# EAGLE design RF Splitter active (EAGLE 9.6.2)
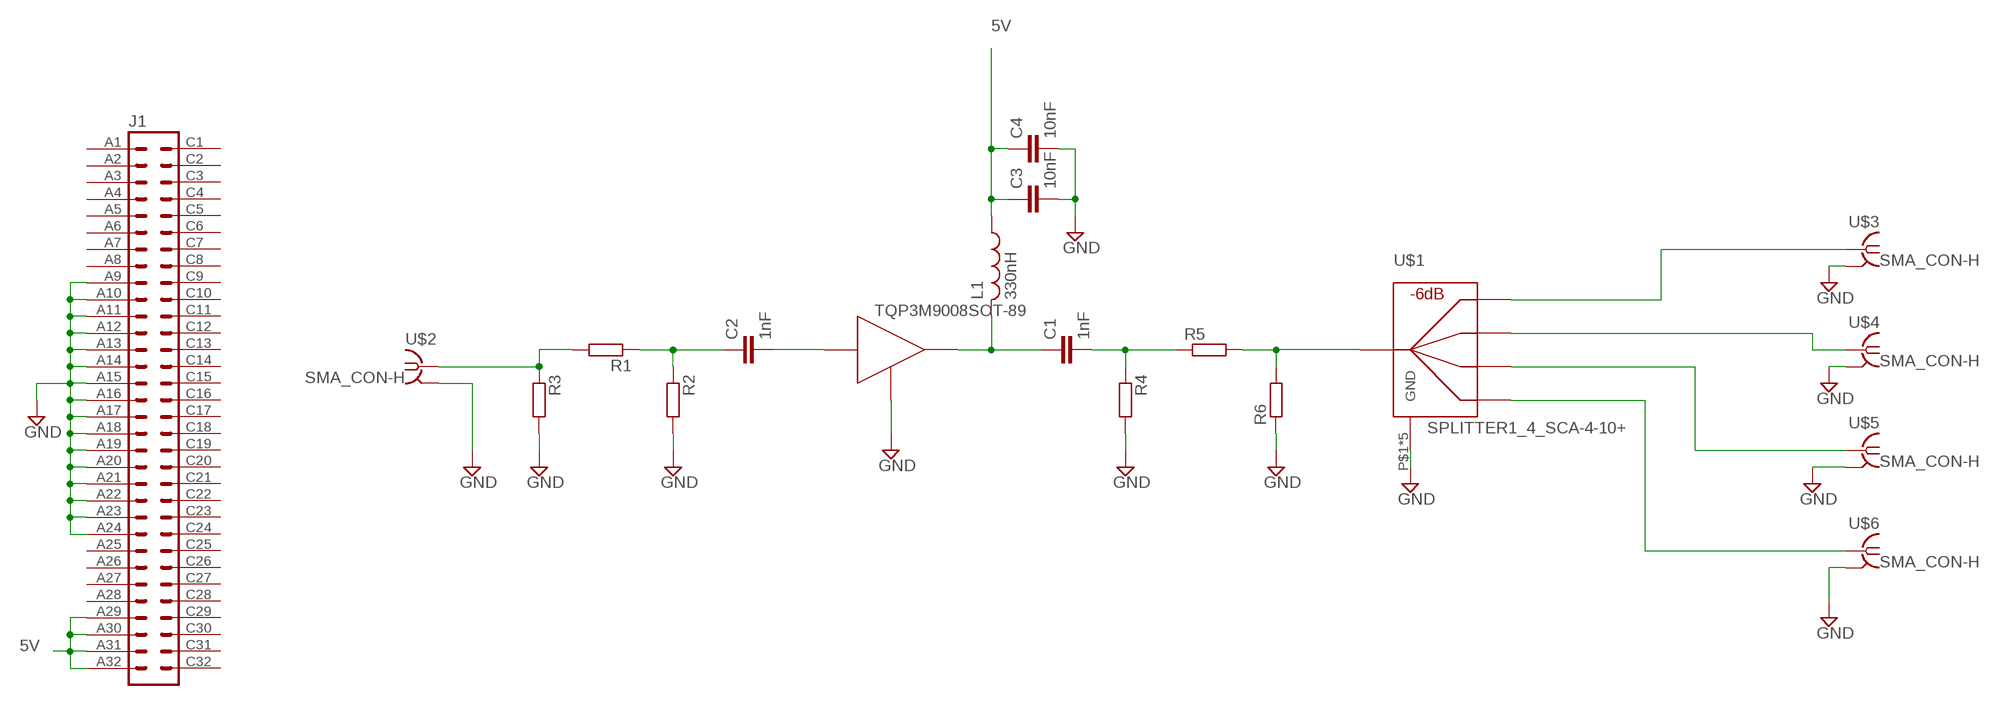
[diagram p0: schematic, sheet 1]

## Parts
C1  1nF  C-EUC0603  [C0603]
C2  1nF  C-EUC0603  [C0603]
C3  10nF  C-EUC0603  [C0603]
C4  10nF  C-EUC0603  [C0603]
J1  VG64P  [VG64P]
L1  330nH  L-USL2012C  [L2012C]
R1  R-EU_R0603  [R0603]
R2  R-EU_R0603  [R0603]
R3  R-EU_R0603  [R0603]
R4  R-EU_R0603  [R0603]
R5  R-EU_R0603  [R0603]
R6  R-EU_R0603  [R0603]
U$1  SPLITTER1_4_SCA-4-10+  [SCA-4-10+]
U$2  SMA_CON-H  [BU-SMA-H]
U$3  SMA_CON-H  [BU-SMA-H]
U$4  SMA_CON-H  [BU-SMA-H]
U$5  SMA_CON-H  [BU-SMA-H]
U$6  SMA_CON-H  [BU-SMA-H]
U$7  TQP3M9008SOT-89  [SOT89]

## Nets
5V: C3.1 C4.1 J1.A29 J1.A30 J1.A31 J1.A32 L1.1
GND: C3.2 C4.2 J1.A9 J1.A10 J1.A11 J1.A12 J1.A13 J1.A14 J1.A15 J1.A16 J1.A17 J1.A18 J1.A19 J1.A20 J1.A21 J1.A22 J1.A23 J1.A24 R2.2 R3.2 R4.2 R6.1 U$1.P$1(GND) U$1.P$2(GND) U$1.P$4(GND) U$1.P$5(GND) U$1.P$8(GND) U$2.2(GND) U$2.3(GND) U$2.4(GND) U$2.5(GND) U$3.2(GND) U$3.3(GND) U$3.4(GND) U$3.5(GND) U$4.2(GND) U$4.3(GND) U$4.4(GND) U$4.5(GND) U$5.2(GND) U$5.3(GND) U$5.4(GND) U$5.5(GND) U$6.2(GND) U$6.3(GND) U$6.4(GND) U$6.5(GND) U$7.2(GND) U$7.2@1(GND)
N$1: C2.2 U$7.1(IN)
N$2: U$1.P$6 U$3.1
N$3: U$1.P$7 U$4.1
N$4: U$1.P$9 U$5.1
N$5: U$1.P$10 U$6.1
N$6: C1.1 L1.2 U$7.3(OUT)
N$8: C1.2 R4.1 R5.1
N$9: R5.2 R6.2 U$1.P$3
N$10: R1.2 R3.1 U$2.1
N$12: C2.1 R1.1 R2.1
Unconnected: J1.A1 J1.A2 J1.A3 J1.A4 J1.A5 J1.A6 J1.A7 J1.A8 J1.A25 J1.A26 J1.A27 J1.A28 J1.C1 J1.C2 J1.C3 J1.C4 J1.C5 J1.C6 J1.C7 J1.C8 J1.C9 J1.C10 J1.C11 J1.C12 J1.C13 J1.C14 J1.C15 J1.C16 J1.C17 J1.C18 J1.C19 J1.C20 J1.C21 J1.C22 J1.C23 J1.C24 J1.C25 J1.C26 J1.C27 J1.C28 J1.C29 J1.C30 J1.C31 J1.C32

## Library data of the parts
C1-C4 = rcl:C-EU: CAPACITOR, European symbol; SPICEPREFIX: C
J1 = 19inch:VG64: PCB EUROCARD, 64-pin type C/AC, 2.54 mm
L1 = rcl:L-US: INDUCTOR, American symbol; SPICEPREFIX: L
R1-R6 = rcl:R-EU_: RESISTOR, European symbol; SPICEPREFIX: R
U$1 = Orzada:SPLITTER1_4: 1:4 Splitter Minicircuits
U$2-U$6 = Orzada:SMA_CON
U$7 = Orzada:TQP3M9008

## Board
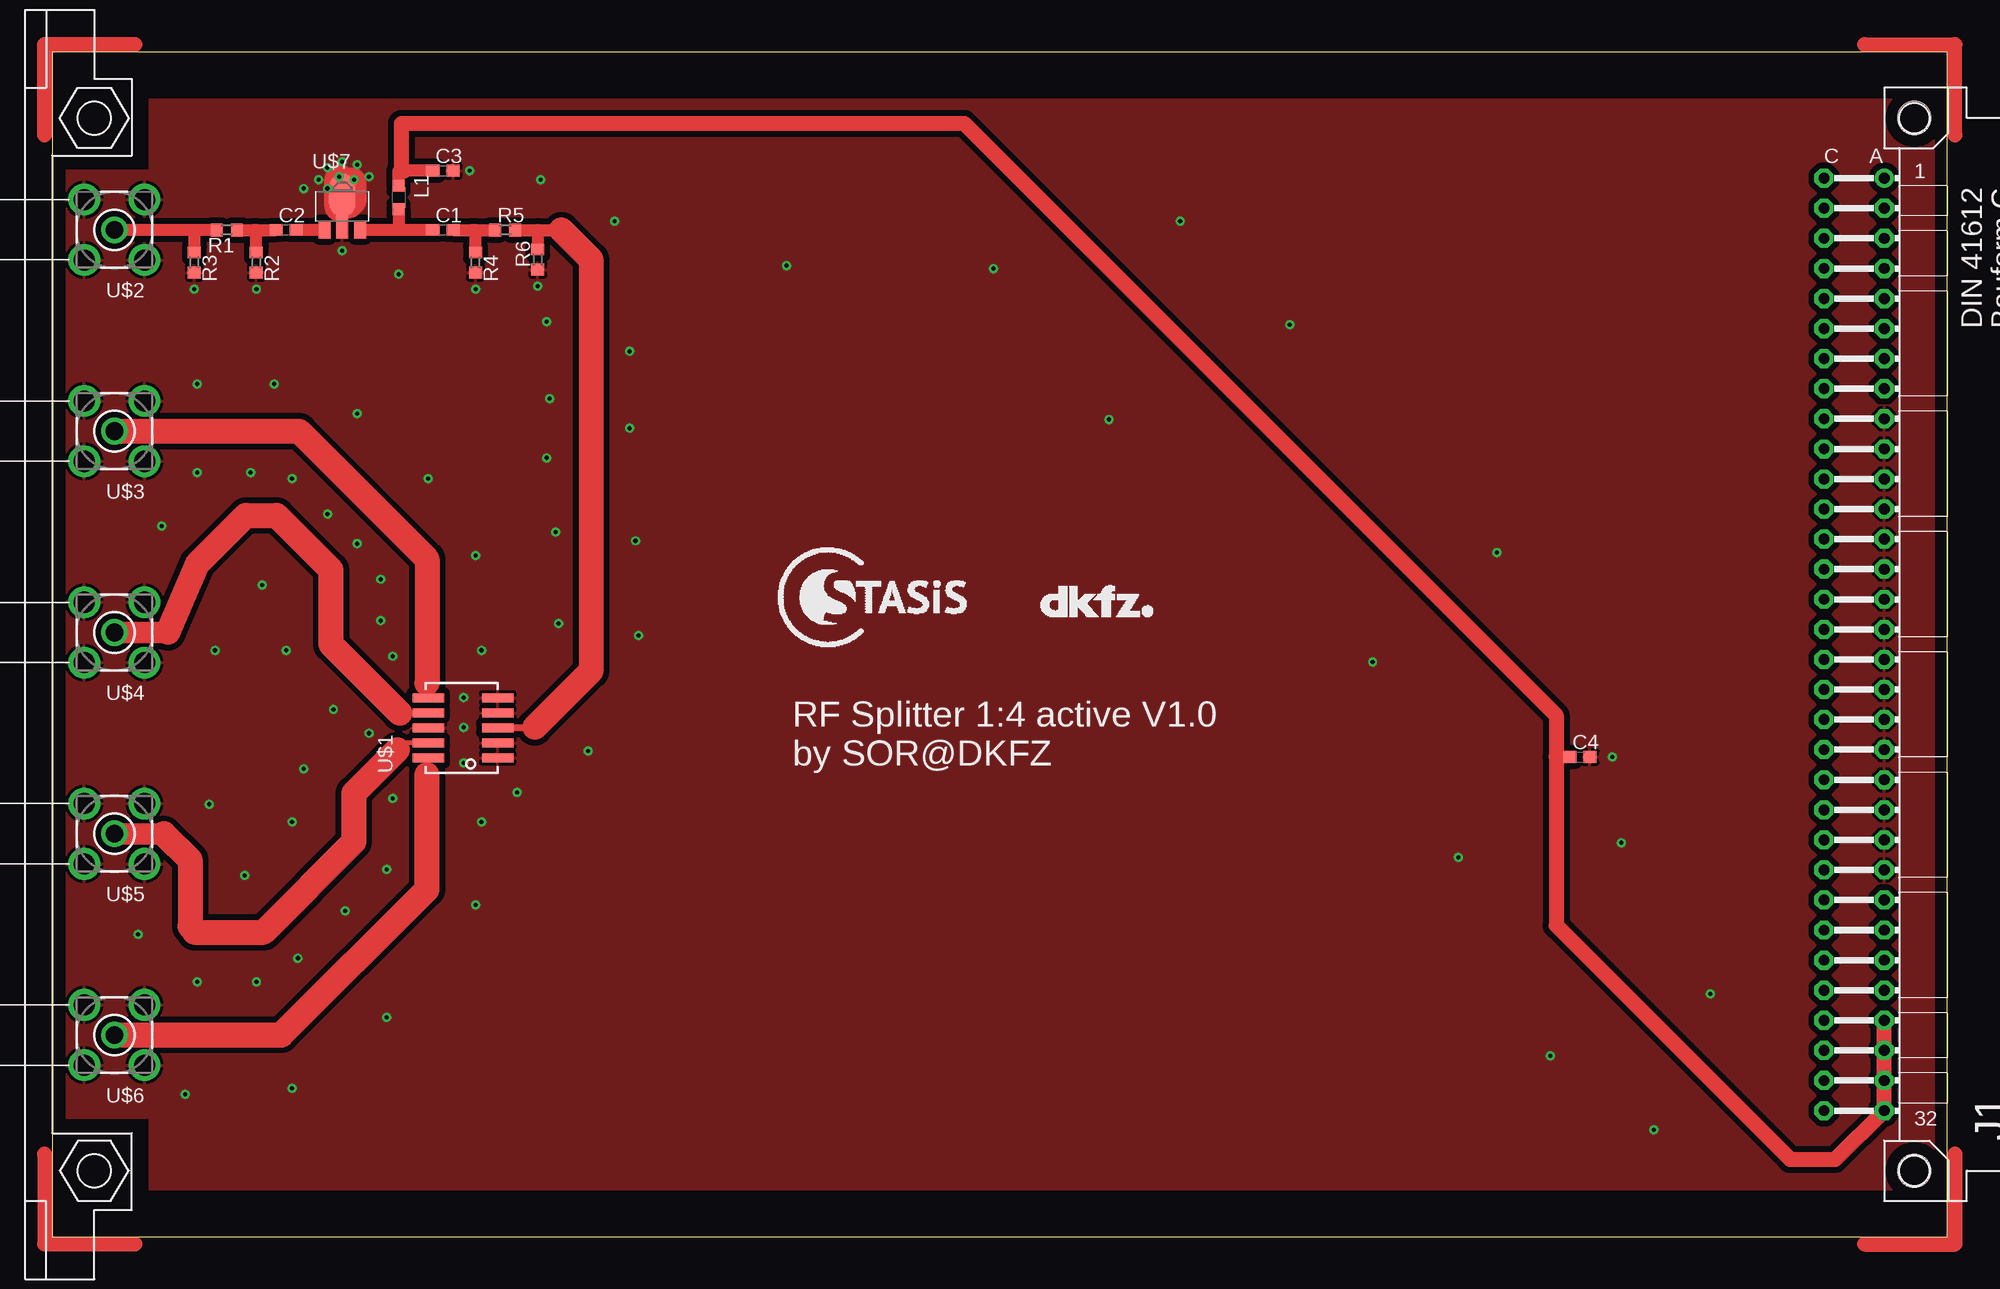
[diagram p1: board, top side]
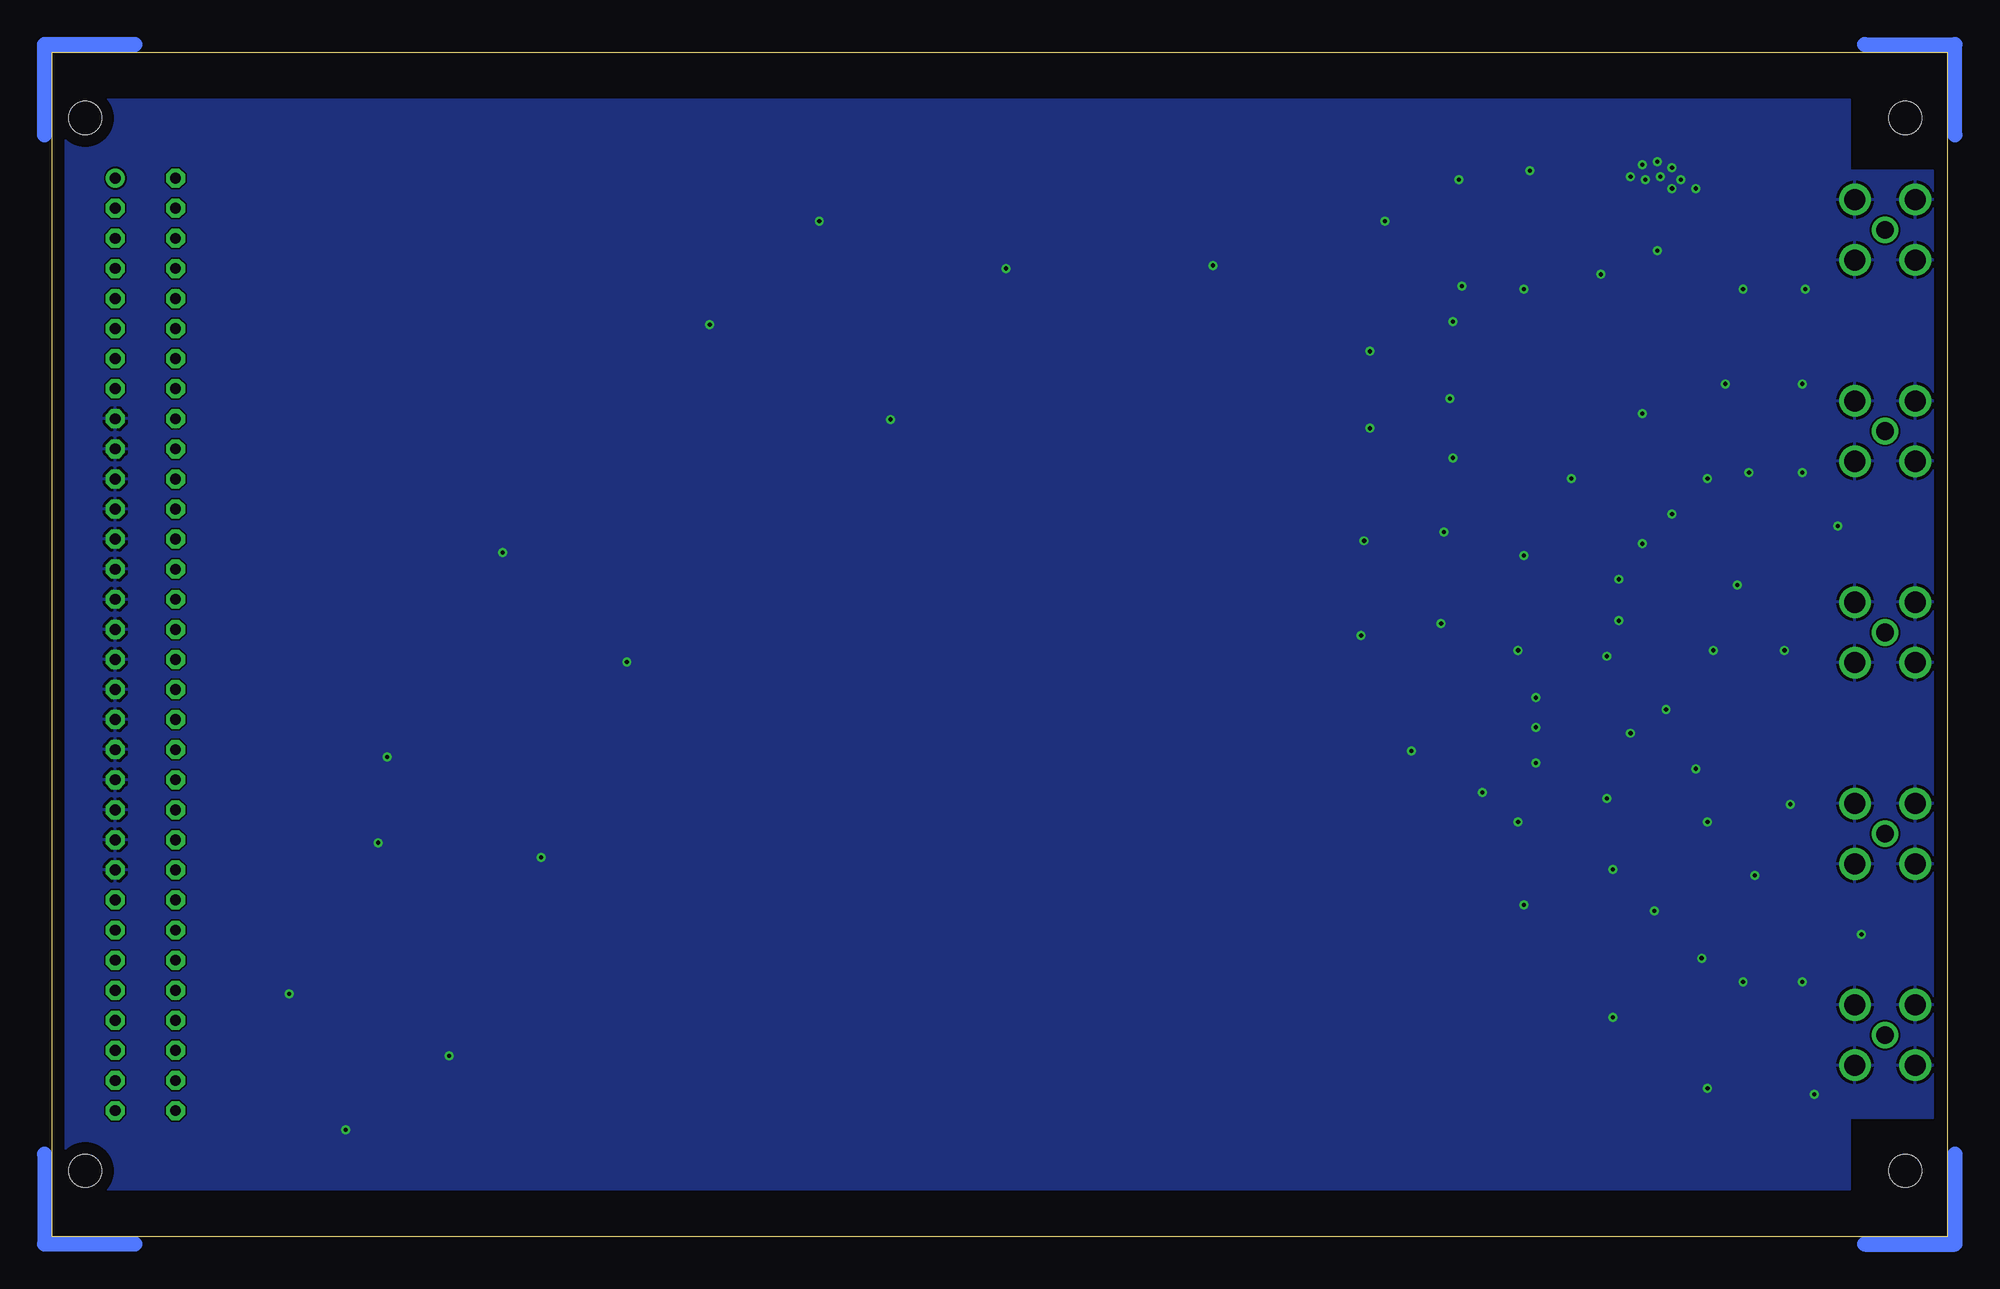
[diagram p2: board, bottom side, seen from below]

Size 160.02 x 100.03 mm. Coordinates in mm from the lower left corner, seen from the top.
Copper layers (1*16): Top 0.035mm / dielectric 1.5mm / Bottom 0.035mm
Design rules "default *": minimum track width 6mil, minimum drill 0.35mm, track to track 6mil, track to pad 6mil, pad to pad 6mil, via to via 6mil, smd to smd 0mil, copper to edge 40mil, drill to drill 6mil, minimum pad ring 10mil, minimum via ring 8mil, stop-mask expansion 4mil, vias tented up to drill 0mil, thermal gap 10mil

### Footprints (pad centres in the part's own frame; a part is rotated, then mirrored left to right if it is on the bottom)
C0603 = smd 1.1 x 1: 1 -0.85,0; 2 0.85,0
VG64P = drill 0.914 pad 1.6: A1 154.94,39.37 | drill 0.914 pad 1.6 octagon: A2 154.94,36.83; A3 154.94,34.29; A4 154.94,31.75; A5 154.94,29.21; A6 154.94,26.67; A7 154.94,24.13; A8 154.94,21.59; A9 154.94,19.05; A10 154.94,16.51; A11 154.94,13.97; A12 154.94,11.43; A13 154.94,8.89; A14 154.94,6.35; A15 154.94,3.81; A16 154.94,1.27; A17 154.94,-1.27; A18 154.94,-3.81; A19 154.94,-6.35; A20 154.94,-8.89; A21 154.94,-11.43; A22 154.94,-13.97; A23 154.94,-16.51; A24 154.94,-19.05; A25 154.94,-21.59; A26 154.94,-24.13; A27 154.94,-26.67; A28 154.94,-29.21; A29 154.94,-31.75; A30 154.94,-34.29; A31 154.94,-36.83; A32 154.94,-39.37; C1 149.86,39.37; C2 149.86,36.83; C3 149.86,34.29; C4 149.86,31.75; C5 149.86,29.21; C6 149.86,26.67; C7 149.86,24.13; C8 149.86,21.59; C9 149.86,19.05; C10 149.86,16.51; C11 149.86,13.97; C12 149.86,11.43; C13 149.86,8.89; C14 149.86,6.35; C15 149.86,3.81; C16 149.86,1.27; C17 149.86,-1.27; C18 149.86,-3.81; C19 149.86,-6.35; C20 149.86,-8.89; C21 149.86,-11.43; C22 149.86,-13.97; C23 149.86,-16.51; C24 149.86,-19.05; C25 149.86,-21.59; C26 149.86,-24.13; C27 149.86,-26.67; C28 149.86,-29.21; C29 149.86,-31.75; C30 149.86,-34.29; C31 149.86,-36.83; C32 149.86,-39.37 | hole 2.794: 3.81,44.45; 3.81,-44.45; 157.48,44.45; 157.48,-44.45
L2012C = smd 1 x 1: 1 -1,0; 2 1,0
R0603 = smd 1 x 1.1: 1 -0.85,0; 2 0.85,0
SCA-4-10+ = smd 0.762 x 2.667: P$1 0,-0.254; P$2 1.27,-0.254; P$3 2.54,-0.254; P$4 3.81,-0.254; P$5 5.08,-0.254; P$6 5.08,5.613; P$7 3.81,5.613; P$8 2.54,5.613; P$9 1.27,5.613; P$10 0,5.613
BU-SMA-H = drill 1.5: 1 0,0 | drill 1.778: 2 -2.55,2.55; 3 2.55,2.55; 4 2.55,-2.55; 5 -2.55,-2.55
SOT89 = smd 1 x 1.5: 1 -1.499,-1.981; 3 1.499,-1.981 | smd 1 x 2: 2 0,-1.727 | smd 2.2 x 3.7: 2@1 0,0.94

### Placement (x,y rotation side)
C1  33,85.01 0 top
C2  19.75,85.01 0 top
C3  33,90.01 0 top
C4  129,40.51 0 top
J1  -0.25,50.01 0 top
L1  29.25,87.76 270 top
R1  14.75,85.01 180 top
R2  17.25,82.26 270 top
R3  12,82.26 270 top
R4  35.75,82.26 270 top
R5  38.25,85.01 0 top
R6  41,82.51 90 top
U$1  37.37,40.42 90 top
U$2  5.26,85.02 180 top
U$3  5.26,68.02 180 top
U$4  5.26,51.02 180 top
U$5  5.26,34.02 180 top
U$6  5.26,17.02 180 top
U$7  24.5,87.01 0 top
U$8  [LOGO_STASIS]  70.25,53.76 0 top
U$9  [LOGO_DKFZ]  83.5,52.26 0 top

### Tracks (layer width: path | path; a pad name or v marks a point on that pad's centre or on a via)
5V
  Top 0.508: C4.1 127,40.51
  Top 1.016: L1.1 29.25,90.01 29.75,90.01 C3.1
  Top 1.27: 29.75,90.01 29.5,90.26 29.5,94.01 77,94.01 127,44.01 127,40.51 127,26.26 146.75,6.51 150.56,6.51 J1.A32 J1.A31 J1.A30 J1.A29
GND  (via drill 0.35)
  Top 2.54: 24.25,87.01 24.25,89.26 24.5,89.01 25.25,89.01 25.25,87.51 25,87.26
  other vias: 12.25,64.51 16.75,64.51 20.25,64.01 23.25,61.01 25.75,58.51 27.75,55.51 27.75,52.01 28.75,49.01 17.75,55.01 13.75,49.51 9.25,60.01 19.75,49.51 23.75,44.51 26.75,42.51 21.25,39.51 20.25,35.01 16.25,30.51 13.25,36.51 28.75,37.01 28.25,31.01 24.75,27.51 20.75,23.51 17.25,21.51 12.25,21.51 7.25,25.51 11.25,12.01 20.25,12.51 28.25,18.51 35.75,28.01 36.25,35.01 34.75,43.01 34.75,45.51 34.75,40.01 39.25,37.51 45.25,41.01 49.5,50.76 49.25,58.76 48.75,74.76 42,70.76 29.25,81.26 41,80.26 35.75,80.01 41.75,77.26 12,80.01 17.25,80.01 24.5,83.26 35.25,90.01 41.75,65.76 42.5,59.51 42.75,51.76 48.75,68.26 36.25,49.51 35.75,57.51 31.75,64.01 25.75,69.51 18.75,72.01 12.25,72.01 47.5,85.76 41.25,89.26 22.5,89.26 23.25,90.26 24.5,90.76 25.75,90.51 26.75,89.51 25.5,89.26 24.25,89.51 23.25,88.51 21.25,88.51 131.75,40.51 122,57.76 111.5,48.51 104.5,77.01 89.25,69.01 95.25,85.76 79.5,81.76 62,82.01 118.75,32.01 126.5,15.26 135.25,9.01 140,20.51 132.5,33.26
  pour Top (isolate 0.5): 8.25,96.01 8.25,90.01 1.25,90.01 1.25,10.01 7.25,10.01 8.25,10.01 8.25,4.01 159.25,4.01 159.25,96.01
  pour Bottom: 8.25,96.01 8.25,90.01 1.25,90.01 1.25,10.01 8.25,10.01 8.25,4.01 159.25,4.01 159.25,96.01
N$1
  Top 1.016: C2.2 20.6,85.03 U$7.1
N$2
  Top 0.406: 31.65,46.71 31.65,45.61 U$1.P$6
  Top 2.1: U$3.1 20.84,68.02 31.65,57.21 31.65,46.71
N$3
  Top 0.406: 29.35,44.21 31.73,44.21 U$1.P$7
  Top 1.8: U$4.1 9.77,51.02
  Top 2.1: 9.77,51.02 12.25,56.81 16.35,60.91 18.95,60.91 23.55,56.31 23.55,50.01 29.35,44.21
N$4
  Top 0.406: 29.15,41.11 29.15,41.69 U$1.P$9
  Top 1.8: U$5.1 9.44,34.02
  Top 2.1: 29.15,41.11 25.47,37.44 25.47,33.34 17.85,25.71 12.02,25.71 11.75,26.11 11.65,26.21 11.65,31.81 9.44,34.02
N$5
  Top 0.406: 31.65,39.01 31.65,40.32 U$1.P$10
  Top 2.1: U$6.1 19.36,17.02 31.65,29.31 31.65,39.01
N$6
  Top 1.016: U$7.3 29.25,85.03 | 29.25,85.03 32.15,85.03 C1.1 | L1.2 29.25,85.03
N$8
  Top 1.016: C1.2 35.5,85.01 35.75,85.01 | 35.75,85.01 R5.1 | R4.1 35.75,85.01
N$9
  Top 0.61: 40.75,43.01 40.7,42.96 U$1.P$3
  Top 1.016: R5.2 41,85.01 | 41,85.01 R6.2 | 41,85.01 43,85.01
  Top 2.1: 43,85.01 45.5,82.51 45.5,47.76 40.75,43.01
N$10
  Top 1.016: U$2.1 12,85.02 | 12,85.02 R3.1 | 12,85.02 R1.2
N$12
  Top 1.016: R1.1 17,85.01 17.25,85.01 | 17.25,85.01 C2.1 | R2.1 17.25,85.01

### Text on the board
tPlace: RF Splitter 1:4 active V1.0 / by SOR@DKFZ